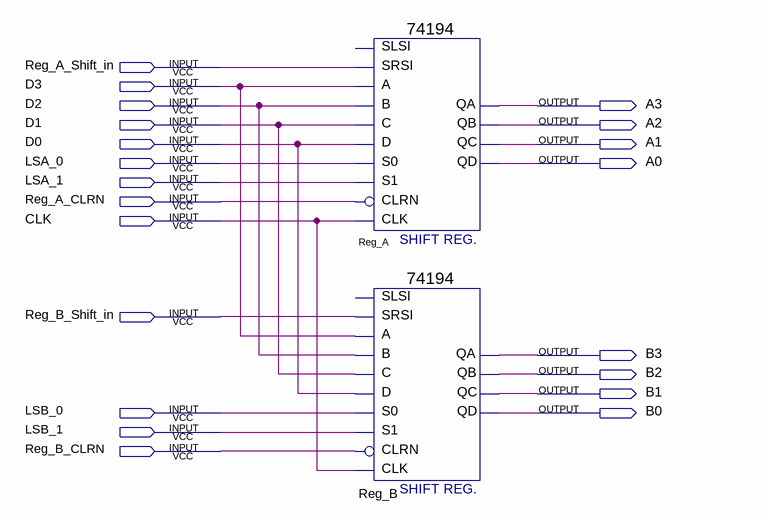
[diagram p0: schematic sheet]
// Quartus schematic 4-bit_logic_processor_schematic_register_unit.bdf as structural Verilog: 2 symbols, 21 pins
module \4-bit_logic_processor_schematic_register_unit  (
  input  Reg_A_Shift_in,
  input  D3,
  input  D2,
  input  D1,
  input  D0,
  input  LSA_0,
  input  LSA_1,
  input  Reg_A_CLRN,
  input  CLK,
  input  Reg_B_Shift_in,
  input  LSB_0,
  input  LSB_1,
  input  Reg_B_CLRN,
  output A3,
  output A2,
  output A1,
  output A0,
  output B3,
  output B2,
  output B1,
  output B0
);

  \74194  Reg_A (
    .SRSI(Reg_A_Shift_in), .B(D2), .C(D1), .CLK(CLK), .CLRN(Reg_A_CLRN), .D(D0), .S1(LSA_1), .S0(LSA_0),
    .A(D3), .QA(A3), .QB(A2), .QC(A1), .QD(A0));  // open: SLSI
  \74194  Reg_B (
    .SRSI(Reg_B_Shift_in), .B(D2), .C(D1), .CLK(CLK), .CLRN(Reg_B_CLRN), .D(D0), .S1(LSB_1), .S0(LSB_0),
    .A(D3), .QA(B3), .QB(B2), .QC(B1), .QD(B0));  // open: SLSI
endmodule
